# Altium schematic sheet BlnTest.SchDoc
size A3; DocumentNumber: 4; SheetNumber: 4; SheetTotal: 5
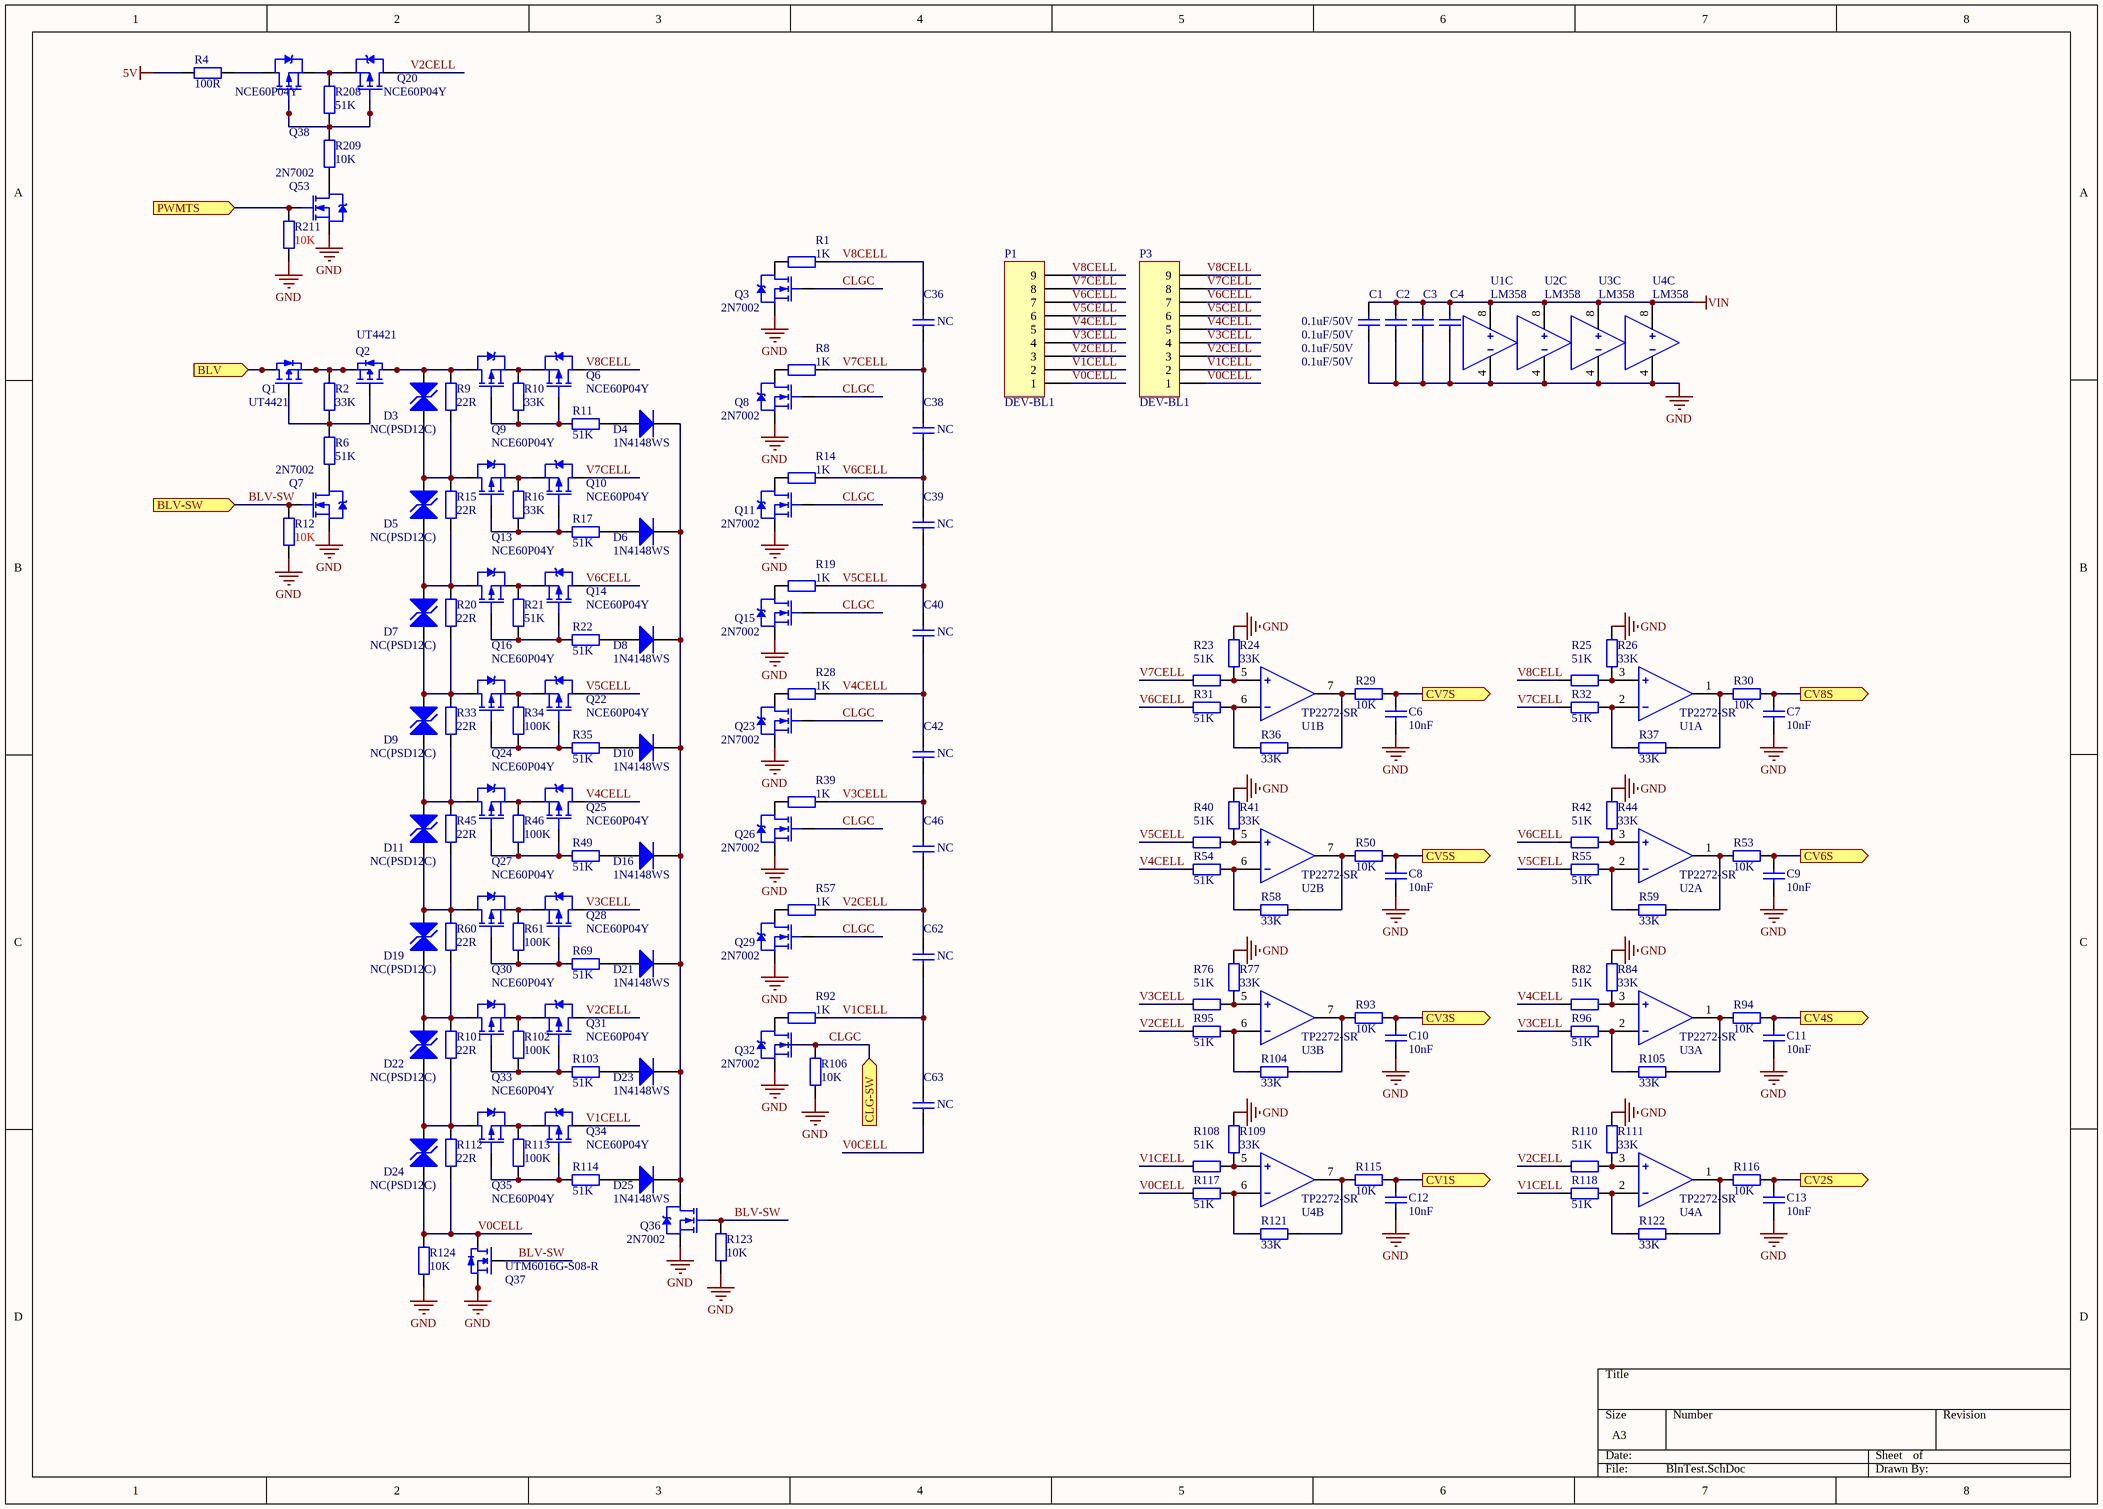
[diagram p0: BlnTest.SchDoc]

## Parts
C1  0.1uF/50V  [C-0603]
C2  0.1uF/50V  [C-0603]
C3  0.1uF/50V  [C-0603]
C4  0.1uF/50V  [C-0603]
C6  10nF  [C-0603]
C7  10nF  [C-0603]
C8  10nF  [C-0603]
C9  10nF  [C-0603]
C10  10nF  [C-0603]
C11  10nF  [C-0603]
C12  10nF  [C-0603]
C13  10nF  [C-0603]
C36  NC  [C-0805]
C38  NC  [C-0805]
C39  NC  [C-0805]
C40  NC  [C-0805]
C42  NC  [C-0805]
C46  NC  [C-0805]
C62  NC  [C-0805]
C63  NC  [C-0805]
D3  NC(PSD12C)  [SOD-323]
D4  1N4148WS  [SOD-323]
D5  NC(PSD12C)  [SOD-323]
D6  1N4148WS  [SOD-323]
D7  NC(PSD12C)  [SOD-323]
D8  1N4148WS  [SOD-323]
D9  NC(PSD12C)  [SOD-323]
D10  1N4148WS  [SOD-323]
D11  NC(PSD12C)  [SOD-323]
D16  1N4148WS  [SOD-323]
D19  NC(PSD12C)  [SOD-323]
D21  1N4148WS  [SOD-323]
D22  NC(PSD12C)  [SOD-323]
D23  1N4148WS  [SOD-323]
D24  NC(PSD12C)  [SOD-323]
D25  1N4148WS  [SOD-323]
P1  DEV-BL1  [XH 2.54-9P]
P3  DEV-BL1  [XH 2.54-9P]
Q1  UT4421  [SOIC8]
Q2  UT4421  [SOIC8]
Q3  2N7002  [SOT23-3]
Q6  NCE60P04Y  [SOT23-3]
Q7  2N7002  [SOT23-3]
Q8  2N7002  [SOT23-3]
Q9  NCE60P04Y  [SOT23-3]
Q10  NCE60P04Y  [SOT23-3]
Q11  2N7002  [SOT23-3]
Q13  NCE60P04Y  [SOT23-3]
Q14  NCE60P04Y  [SOT23-3]
Q15  2N7002  [SOT23-3]
Q16  NCE60P04Y  [SOT23-3]
Q20  NCE60P04Y  [SOT23-3]
Q22  NCE60P04Y  [SOT23-3]
Q23  2N7002  [SOT23-3]
Q24  NCE60P04Y  [SOT23-3]
Q25  NCE60P04Y  [SOT23-3]
Q26  2N7002  [SOT23-3]
Q27  NCE60P04Y  [SOT23-3]
Q28  NCE60P04Y  [SOT23-3]
Q29  2N7002  [SOT23-3]
Q30  NCE60P04Y  [SOT23-3]
Q31  NCE60P04Y  [SOT23-3]
Q32  2N7002  [SOT23-3]
Q33  NCE60P04Y  [SOT23-3]
Q34  NCE60P04Y  [SOT23-3]
Q35  NCE60P04Y  [SOT23-3]
Q36  2N7002  [SOT23-3]
Q37  UTM6016G-S08-R  [SOIC8]
Q38  NCE60P04Y  [SOT23-3]
Q53  2N7002  [SOT23-3]
R1  1K  [R-0603]
R2  33K  [R-0603]
R4  100R  [R-0603]
R6  51K  [R-0603]
R8  1K  [R-0603]
R9  22R  [RES 3W-S]
R10  33K  [R-0603]
R11  51K  [R-0603]
R12  10K  [R-0603]
R14  1K  [R-0603]
R15  22R  [RES 3W-S]
R16  33K  [R-0603]
R17  51K  [R-0603]
R19  1K  [R-0603]
R20  22R  [RES 3W-S]
R21  51K  [R-0603]
R22  51K  [R-0603]
R23  51K  [R-0603]
R24  33K  [R-0603]
R25  51K  [R-0603]
R26  33K  [R-0603]
R28  1K  [R-0603]
R29  10K  [R-0603]
R30  10K  [R-0603]
R31  51K  [R-0603]
R32  51K  [R-0603]
R33  22R  [RES 3W-S]
R34  100K  [R-0603]
R35  51K  [R-0603]
R36  33K  [R-0603]
R37  33K  [R-0603]
R39  1K  [R-0603]
R40  51K  [R-0603]
R41  33K  [R-0603]
R42  51K  [R-0603]
R44  33K  [R-0603]
R45  22R  [RES 3W-S]
R46  100K  [R-0603]
R49  51K  [R-0603]
R50  10K  [R-0603]
R53  10K  [R-0603]
R54  51K  [R-0603]
R55  51K  [R-0603]
R57  1K  [R-0603]
R58  33K  [R-0603]
R59  33K  [R-0603]
R60  22R  [RES 3W-S]
R61  100K  [R-0603]
R69  51K  [R-0603]
R76  51K  [R-0603]
R77  33K  [R-0603]
R82  51K  [R-0603]
R84  33K  [R-0603]
R92  1K  [R-0603]
R93  10K  [R-0603]
R94  10K  [R-0603]
R95  51K  [R-0603]
R96  51K  [R-0603]
R101  22R  [RES 3W-S]
R102  100K  [R-0603]
R103  51K  [R-0603]
R104  33K  [R-0603]
R105  33K  [R-0603]
R106  10K  [R-0603]
R108  51K  [R-0603]
R109  33K  [R-0603]
R110  51K  [R-0603]
R111  33K  [R-0603]
R112  22R  [RES 3W-S]
R113  100K  [R-0603]
R114  51K  [R-0603]
R115  10K  [R-0603]
R116  10K  [R-0603]
R117  51K  [R-0603]
R118  51K  [R-0603]
R121  33K  [R-0603]
R122  33K  [R-0603]
R123  10K  [R-0603]
R124  10K  [R-1206]
R208  51K  [R-0603]
R209  10K  [R-0603]
R211  10K  [R-0603]
U1  TP2272-SR  [SOIC8]  (parts A,B,C of 3)
U2  TP2272-SR  [SOIC8]  (parts A,B,C of 3)
U3  TP2272-SR  [SOIC8]  (parts A,B,C of 3)
U4  TP2272-SR  [SOIC8]  (parts A,B,C of 3)

## Ports
BLV (in), BLV-SW (in), CLG-SW (in), CV1S (out), CV2S (out), CV3S (out), CV4S (out), CV5S (out), CV6S (out), CV7S (out), CV8S (out), PWMTS (in)

## Nets
5V: R4.2
GND: C1.2 C2.2 C3.2 C4.2 C6.1 C7.1 C8.1 C9.1 C10.1 C11.1 C12.1 C13.1 Q3.2(D) Q7.2(D) Q8.2(D) Q11.2(D) Q15.2(D) Q23.2(D) Q26.2(D) Q29.2(D) Q32.2(D) Q36.2(D) Q37.1(S) Q37.2(S) Q37.3(S) Q53.2(D) R12.2 R24.1 R26.1 R41.1 R44.1 R77.1 R84.1 R106.1 R109.1 R111.1 R123.2 R124.1 R211.2 U1.4 U2.4 U3.4 U4.4
VIN: C1.1 C2.1 C3.1 C4.1 U1.8 U2.8 U3.8 U4.8
BLV: Q1.5(D) Q1.6(D) Q1.7(D) Q1.8(D) ; port BLV
BLV-SW: Q7.1(G) Q36.1(G) Q37.4(G) R12.1 R123.1 ; port BLV-SW
CLGC: Q3.1(G) Q8.1(G) Q11.1(G) Q15.1(G) Q23.1(G) Q26.1(G) Q29.1(G) Q32.1(G) R106.2 ; port CLG-SW
CV1S: C12.2 R115.1 ; port CV1S
CV2S: C13.2 R116.1 ; port CV2S
CV3S: C10.2 R93.1 ; port CV3S
CV4S: C11.2 R94.1 ; port CV4S
CV5S: C8.2 R50.1 ; port CV5S
CV6S: C9.2 R53.1 ; port CV6S
CV7S: C6.2 R29.1 ; port CV7S
CV8S: C7.2 R30.1 ; port CV8S
PWMTS: Q53.1(G) R211.1 ; port PWMTS
V0CELL: C63.2 D24.2 P1.1 P3.1 Q37.5(D) Q37.6(D) Q37.7(D) Q37.8(D) R112.1 R117.1 R124.2
V1CELL: C62.2 C63.1 P1.2 P3.2 Q34.3(D) R92.2 R108.2 R118.1
V2CELL: C46.2 C62.1 P1.3 P3.3 Q20.3(D) Q31.3(D) R57.2 R95.1 R110.2
V3CELL: C42.2 C46.1 P1.4 P3.4 Q28.3(D) R39.2 R76.2 R96.1
V4CELL: C40.2 C42.1 P1.5 P3.5 Q25.3(D) R28.2 R54.1 R82.2
V5CELL: C39.2 C40.1 P1.6 P3.6 Q22.3(D) R19.2 R40.2 R55.1
V6CELL: C38.2 C39.1 P1.7 P3.7 Q14.3(D) R14.2 R31.1 R42.2
V7CELL: C36.2 C38.1 P1.8 P3.8 Q10.3(D) R8.2 R23.2 R32.1
V8CELL: C36.1 P1.9 P3.9 Q6.3(D) R1.2 R25.2
NetD3_1: D3.1 Q2.5(D) Q2.6(D) Q2.7(D) Q2.8(D) Q9.3(D) R9.2
NetD3_2: D3.2 D5.1 Q13.3(D) R9.1 R15.2
NetD4_1: D4.1(A) R11.1
NetD4_2: D4.2(K) D6.2(K) D8.2(K) D10.2(K) D16.2(K) D21.2(K) D23.2(K) D25.2(K) Q36.3(S)
NetD5_2: D5.2 D7.1 Q16.3(D) R15.1 R20.2
NetD6_1: D6.1(A) R17.1
NetD7_2: D7.2 D9.1 Q24.3(D) R20.1 R33.2
NetD8_1: D8.1(A) R22.1
NetD9_2: D9.2 D11.1 Q27.3(D) R33.1 R45.2
NetD10_1: D10.1(A) R35.1
NetD11_2: D11.2 D19.1 Q30.3(D) R45.1 R60.2
NetD16_1: D16.1(A) R49.1
NetD19_2: D19.2 D22.1 Q33.3(D) R60.1 R101.2
NetD21_1: D21.1(A) R69.1
NetD22_2: D22.2 D24.1 Q35.3(D) R101.1 R112.2
NetD23_1: D23.1(A) R103.1
NetD25_1: D25.1(A) R114.1
NetQ1_1: Q1.1(S) Q1.2(S) Q1.3(S) Q2.1(S) Q2.2(S) Q2.3(S) R2.2
NetQ1_4: Q1.4(G) Q2.4(G) R2.1 R6.2
NetQ3_3: Q3.3(S) R1.1
NetQ6_1: Q6.1(G) Q9.1(G) R10.2 R11.2
NetQ6_2: Q6.2(S) Q9.2(S) R10.1
NetQ7_3: Q7.3(S) R6.1
NetQ8_3: Q8.3(S) R8.1
NetQ10_1: Q10.1(G) Q13.1(G) R16.2 R17.2
NetQ10_2: Q10.2(S) Q13.2(S) R16.1
NetQ11_3: Q11.3(S) R14.1
NetQ14_1: Q14.1(G) Q16.1(G) R21.2 R22.2
NetQ14_2: Q14.2(S) Q16.2(S) R21.1
NetQ15_3: Q15.3(S) R19.1
NetQ20_1: Q20.1(G) Q38.1(G) R208.1 R209.2
NetQ20_2: Q20.2(S) Q38.2(S) R208.2
NetQ22_1: Q22.1(G) Q24.1(G) R34.2 R35.2
NetQ22_2: Q22.2(S) Q24.2(S) R34.1
NetQ23_3: Q23.3(S) R28.1
NetQ25_1: Q25.1(G) Q27.1(G) R46.2 R49.2
NetQ25_2: Q25.2(S) Q27.2(S) R46.1
NetQ26_3: Q26.3(S) R39.1
NetQ28_1: Q28.1(G) Q30.1(G) R61.2 R69.2
NetQ28_2: Q28.2(S) Q30.2(S) R61.1
NetQ29_3: Q29.3(S) R57.1
NetQ31_1: Q31.1(G) Q33.1(G) R102.2 R103.2
NetQ31_2: Q31.2(S) Q33.2(S) R102.1
NetQ32_3: Q32.3(S) R92.1
NetQ34_1: Q34.1(G) Q35.1(G) R113.2 R114.2
NetQ34_2: Q34.2(S) Q35.2(S) R113.1
NetQ38_3: Q38.3(D) R4.1
NetQ53_3: Q53.3(S) R209.1
NetR23_1: R23.1 R24.2 U1.5
NetR25_1: R25.1 R26.2 U1.3
NetR29_2: R29.2 R36.2 U1.7
NetR30_2: R30.2 R37.2 U1.1
NetR31_2: R31.2 R36.1 U1.6
NetR32_2: R32.2 R37.1 U1.2
NetR40_1: R40.1 R41.2 U2.5
NetR42_1: R42.1 R44.2 U2.3
NetR50_2: R50.2 R58.2 U2.7
NetR53_2: R53.2 R59.2 U2.1
NetR54_2: R54.2 R58.1 U2.6
NetR55_2: R55.2 R59.1 U2.2
NetR76_1: R76.1 R77.2 U3.5
NetR82_1: R82.1 R84.2 U3.3
NetR93_2: R93.2 R104.2 U3.7
NetR94_2: R94.2 R105.2 U3.1
NetR95_2: R95.2 R104.1 U3.6
NetR96_2: R96.2 R105.1 U3.2
NetR108_1: R108.1 R109.2 U4.5
NetR110_1: R110.1 R111.2 U4.3
NetR115_2: R115.2 R121.2 U4.7
NetR116_2: R116.2 R122.2 U4.1
NetR117_2: R117.2 R121.1 U4.6
NetR118_2: R118.2 R122.1 U4.2

## Library data of the parts
C1-C4 C6-C13 C36 C38-C40 C42 C46 C62 C63 = Cap: Capacitor; Published: 8-Jun-2000; LatestRevisionDate: 17-Jul-2002; LatestRevisionNote: Re-released for DXP Platform.; PackageReference: RAD-0.3; Publisher: Altium Limited
  C1-C4: Value: 0.1uF/50V
  C6-C13: Value: 10nF
  C36 C38-C40 C42 C46 C62 C63: Value: NC
D3 D5 D7 D9 D11 D19 D22 D24 = TVS-D
D4 D6 D8 D10 D16 D21 D23 D25 = Diode: Default Diode; Published: 8-Jun-2000; LatestRevisionDate: 17-Jul-2002; LatestRevisionNote: Re-released for DXP Platform.; PackageVersion: Sep-1996; PackageReference: SMC; Publisher: Altium Limited; PackageDescription: DO-214-AB/SMC; 2 C-Bend Leads; Body 7.9 x 5.9 mm, inc. leads (LxW); Code_JEDEC: DO-214-AB
P1 P3 = Header 9: Header, 9-Pin; LatestRevisionDate: 17-Jul-2002; LatestRevisionNote: Re-released for DXP Platform.; Publisher: Altium Limited
Q1 Q2 = SO8-PMOS
Q3 Q7 Q8 Q11 Q15 Q23 Q26 Q29 Q32 Q36 Q53 = NMOS-2: N-Channel Power MOSFET; Note: Pin 2 is electrically connected to pin 4.; Published: 8-Jun-2000; LatestRevisionDate: 17-Jul-2002; LatestRevisionNote: Re-released for DXP Platform.; DatasheetVersion: PD-9.814; PackageVersion: Feb-1997; PackageReference: TO-220AB; Publisher: Altium Limited; PackageDescription: TO, Thru-Hole, Vertical, Heatsink Mounted; 3 In-Line Leads; Pitch 2.54 mm; ComponentLink1Description: Manufacturer Link; ComponentLink1URL: http://www.irf.com/
Q6 Q9 Q10 Q13 Q14 Q16 Q20 Q22 Q24 Q25 Q27 Q28 Q30 Q31 Q33-Q35 Q38 = PMOS-2: P-Channel Power MOSFET; Note: Pin 4 not drawn and electrically connected to Pin 2.; Published: 8-Jun-2000; LatestRevisionDate: 17-Jul-2002; LatestRevisionNote: Re-released for DXP Platform.; DatasheetVersion: PD-9.390D; PackageVersion: Feb-1997; PackageReference: TO-220AB; Publisher: Altium Limited; PackageDescription: TO, Thru-Hole, Vertical, Heatsink Mounted; 3 In-Line Leads; Pitch 2.54 mm; ComponentLink1Description: Manufacturer Link; ComponentLink1URL: http://www.irf.com/
Q37 = SO8-NMOS
R1 R2 R4 R6 R8-R12 R14-R17 R19-R26 R28-R37 R39-R42 R44-R46 R49 R50 R53-R55 R57-R61 R69 R76 R77 R82 R84 R92-R96 R101-R106 R108-R118 R121-R124 R208 R209 R211 = Res2: Resistor; Published: 8-Jun-2000; LatestRevisionDate: 17-Jul-2002; LatestRevisionNote: Re-released for DXP Platform.; Publisher: Altium Limited
  R1 R8 R14 R19 R28 R39 R57 R92: PackageReference: AXIAL-0.4; Value: 1K
  R2 R24 R26 R36 R37 R41 R44 R58 R59 R77 R84 R104 R105 R109 R111 R121 R122: PackageReference: AXIAL-0.4; Value: 33K
  R4: PackageReference: AXIAL-0.4; Value: 100R
  R6 R23 R25 R31 R32 R40 R42 R54 R55 R76 R82 R95 R96 R108 R110 R117 R118 R208: PackageReference: AXIAL-0.4; Value: 51K
  R9 R15 R20 R33 R45 R60 R101 R112: Value: 22R
  R10 R16: PackageReference: AXIAL-0.4; PackageDescription: Axial Device, Thru-Hole; 2 Leads; 0.4 in Pin Spacing; Value: 33K
  R11 R17 R21 R22 R35 R49 R69 R103 R114: PackageReference: AXIAL-0.4; PackageDescription: Axial Device, Thru-Hole; 2 Leads; 0.4 in Pin Spacing; Value: 51K
  R12 R29 R30 R50 R53 R93 R94 R106 R115 R116 R123 R124 R209 R211: PackageReference: AXIAL-0.4; Value: 10K
  R34 R46 R61 R102 R113: PackageReference: AXIAL-0.4; PackageDescription: Axial Device, Thru-Hole; 2 Leads; 0.4 in Pin Spacing; Value: 100K
U1-U4 = Dual_OPAMP